# Altium schematic sheet PAGE1 - CONTENTS.SchDoc
size A3
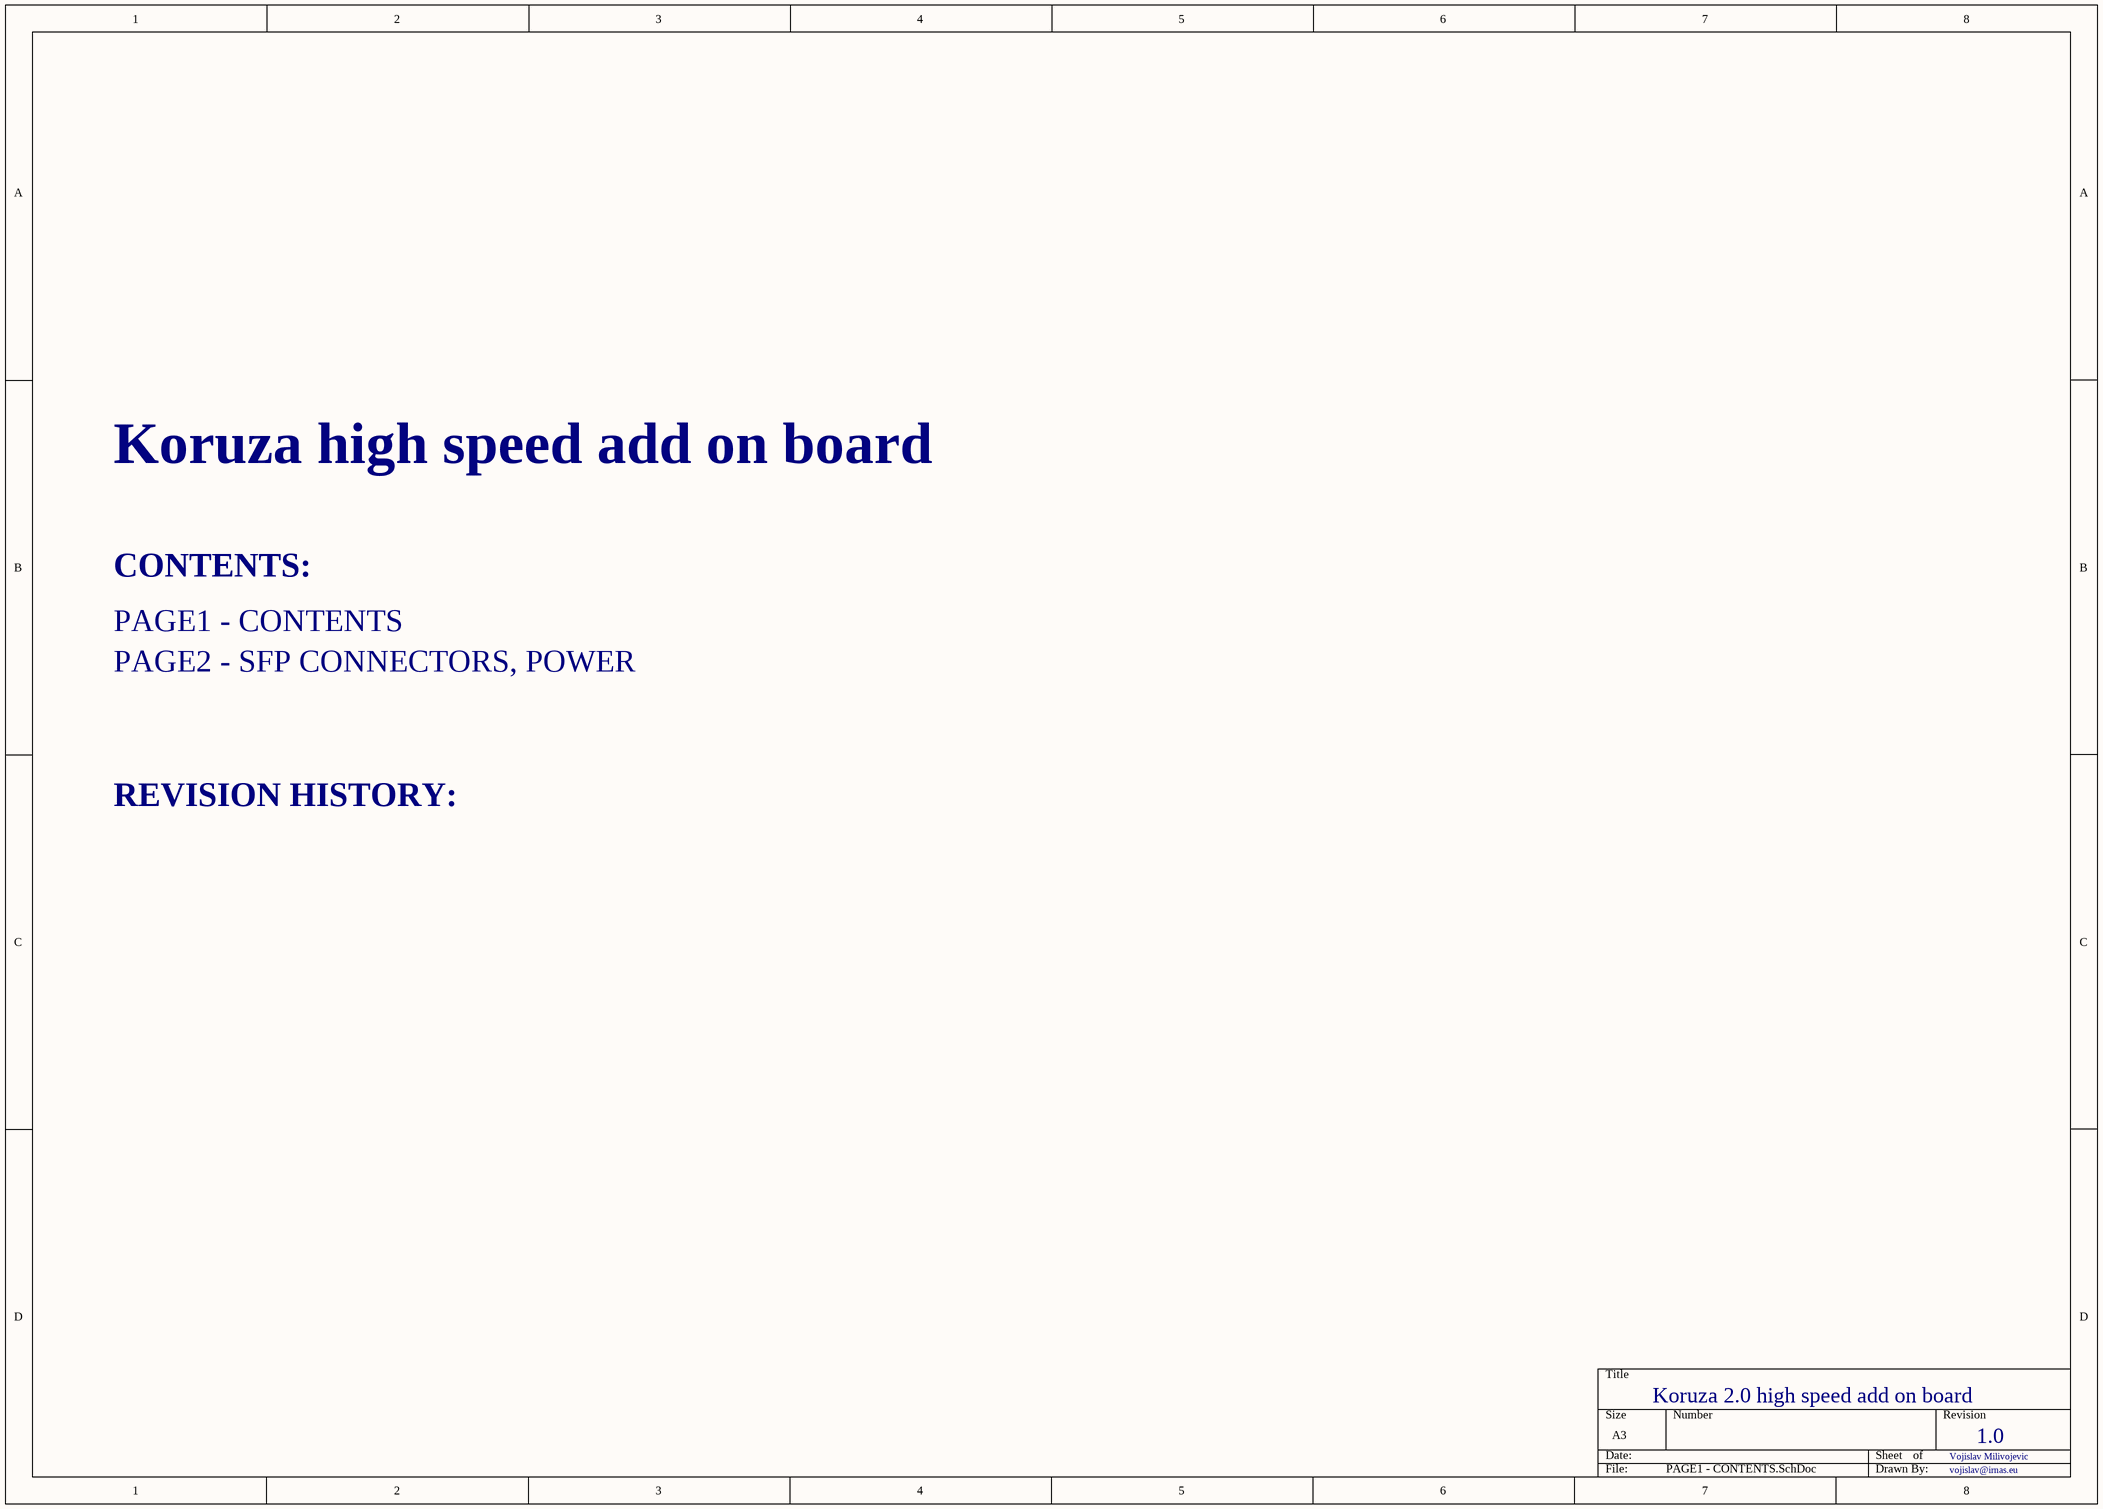
[diagram p0: PAGE1 - CONTENTS.SchDoc]

## Notes on the sheet
- Koruza high speed add on board
- CONTENTS:
- PAGE1 - CONTENTS
- PAGE2 - SFP CONNECTORS, POWER
- REVISION HISTORY:
- Koruza 2.0 high speed add on board
- Vojislav Milivojevic
- 1.0
- vojislav@irnas.eu